# EAGLE design W107X (EAGLE 6.6.0)
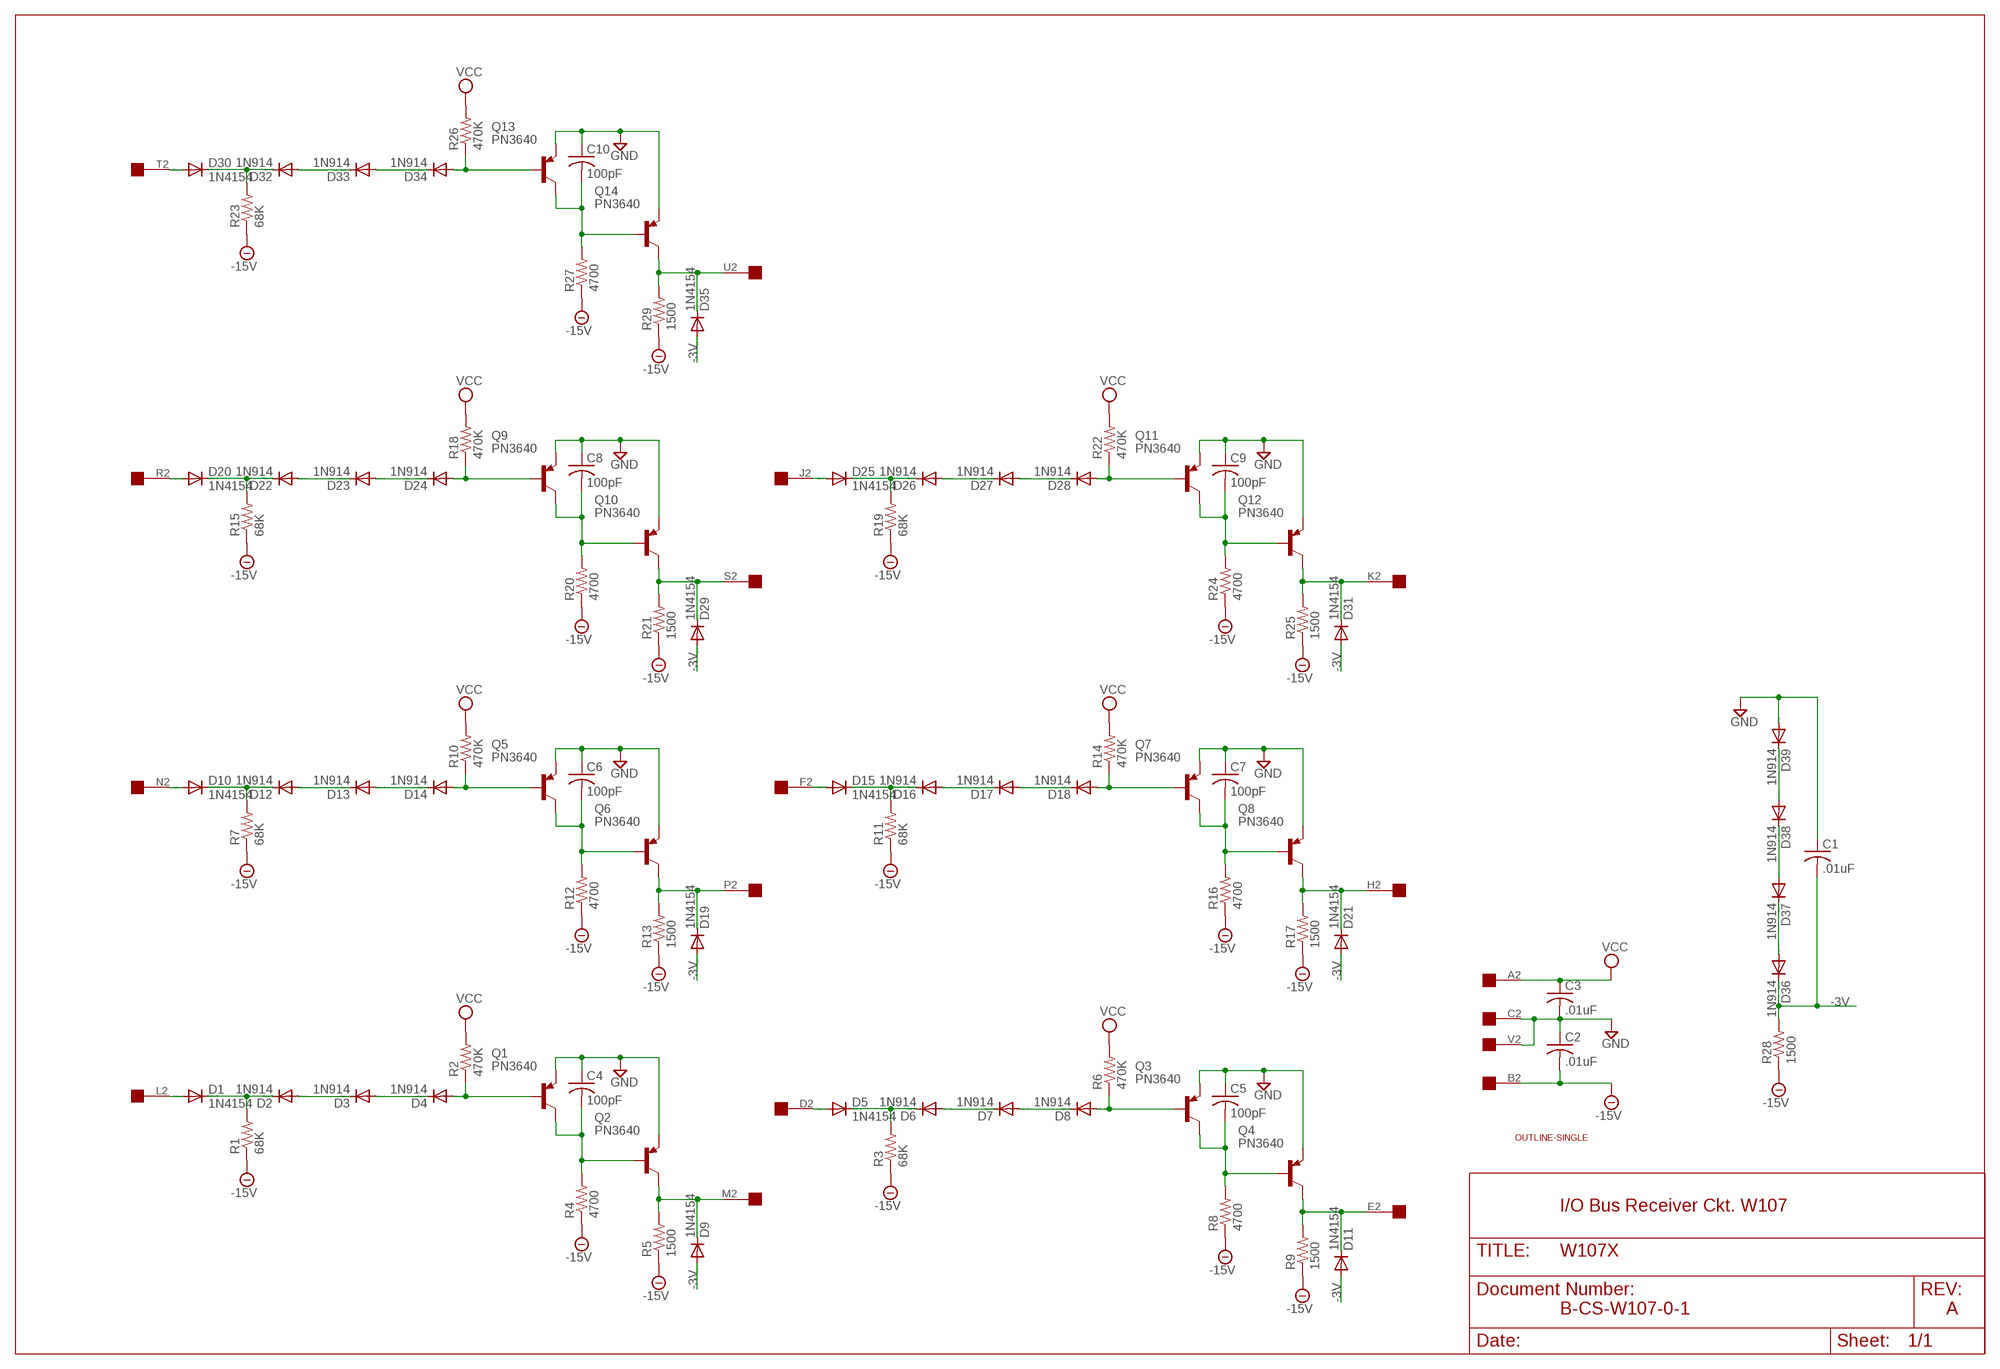
[diagram p0: schematic, sheet 1]

## Parts
C1  .01uF  C-US  [C063-025X075]
C2  .01uF  C-US  [C063-025X075]
C3  .01uF  C-US  [C063-025X075]
C4  100pF  C-US  [C063-025X075]
C5  100pF  C-US  [C063-025X075]
C6  100pF  C-US  [C063-025X075]
C7  100pF  C-US  [C063-025X075]
C8  100pF  C-US  [C063-025X075]
C9  100pF  C-US  [C063-025X075]
C10  100pF  C-US  [C063-025X075]
D1  1N4154  DIODE-DO35-10  [DO35-10]
D2  1N914  DIODE-DO35-10  [DO35-10]
D3  1N914  DIODE-DO35-10  [DO35-10]
D4  1N914  DIODE-DO35-10  [DO35-10]
D5  1N4154  DIODE-DO35-10  [DO35-10]
D6  1N914  DIODE-DO35-10  [DO35-10]
D7  1N914  DIODE-DO35-10  [DO35-10]
D8  1N914  DIODE-DO35-10  [DO35-10]
D9  1N4154  DIODE-DO35-10  [DO35-10]
D10  1N4154  DIODE-DO35-10  [DO35-10]
D11  1N4154  DIODE-DO35-10  [DO35-10]
D12  1N914  DIODE-DO35-10  [DO35-10]
D13  1N914  DIODE-DO35-10  [DO35-10]
D14  1N914  DIODE-DO35-10  [DO35-10]
D15  1N4154  DIODE-DO35-10  [DO35-10]
D16  1N914  DIODE-DO35-10  [DO35-10]
D17  1N914  DIODE-DO35-10  [DO35-10]
D18  1N914  DIODE-DO35-10  [DO35-10]
D19  1N4154  DIODE-DO35-10  [DO35-10]
D20  1N4154  DIODE-DO35-10  [DO35-10]
D21  1N4154  DIODE-DO35-10  [DO35-10]
D22  1N914  DIODE-DO35-10  [DO35-10]
D23  1N914  DIODE-DO35-10  [DO35-10]
D24  1N914  DIODE-DO35-10  [DO35-10]
D25  1N4154  DIODE-DO35-10  [DO35-10]
D26  1N914  DIODE-DO35-10  [DO35-10]
D27  1N914  DIODE-DO35-10  [DO35-10]
D28  1N914  DIODE-DO35-10  [DO35-10]
D29  1N4154  DIODE-DO35-10  [DO35-10]
D30  1N4154  DIODE-DO35-10  [DO35-10]
D31  1N4154  DIODE-DO35-10  [DO35-10]
D32  1N914  DIODE-DO35-10  [DO35-10]
D33  1N914  DIODE-DO35-10  [DO35-10]
D34  1N914  DIODE-DO35-10  [DO35-10]
D35  1N4154  DIODE-DO35-10  [DO35-10]
D36  1N914  DIODE-DO35-10  [DO35-10]
D37  1N914  DIODE-DO35-10  [DO35-10]
D38  1N914  DIODE-DO35-10  [DO35-10]
D39  1N914  DIODE-DO35-10  [DO35-10]
Q1  PN3640  -PNP-TO5  [TO5]
Q2  PN3640  -PNP-TO5  [TO5]
Q3  PN3640  -PNP-TO5  [TO5]
Q4  PN3640  -PNP-TO5  [TO5]
Q5  PN3640  -PNP-TO5  [TO5]
Q6  PN3640  -PNP-TO5  [TO5]
Q7  PN3640  -PNP-TO5  [TO5]
Q8  PN3640  -PNP-TO5  [TO5]
Q9  PN3640  -PNP-TO5  [TO5]
Q10  PN3640  -PNP-TO5  [TO5]
Q11  PN3640  -PNP-TO5  [TO5]
Q12  PN3640  -PNP-TO5  [TO5]
Q13  PN3640  -PNP-TO5  [TO5]
Q14  PN3640  -PNP-TO5  [TO5]
R1  68K  R-US_0207/10  [0207/10]
R2  470K  R-US_0207/10  [0207/10]
R3  68K  R-US_0207/10  [0207/10]
R4  4700  R-US_0207/10  [0207/10]
R5  1500  R-US_0207/10  [0207/10]
R6  470K  R-US_0207/10  [0207/10]
R7  68K  R-US_0207/10  [0207/10]
R8  4700  R-US_0207/10  [0207/10]
R9  1500  R-US_0207/10  [0207/10]
R10  470K  R-US_0207/10  [0207/10]
R11  68K  R-US_0207/10  [0207/10]
R12  4700  R-US_0207/10  [0207/10]
R13  1500  R-US_0207/10  [0207/10]
R14  470K  R-US_0207/10  [0207/10]
R15  68K  R-US_0207/10  [0207/10]
R16  4700  R-US_0207/10  [0207/10]
R17  1500  R-US_0207/10  [0207/10]
R18  470K  R-US_0207/10  [0207/10]
R19  68K  R-US_0207/10  [0207/10]
R20  4700  R-US_0207/10  [0207/10]
R21  1500  R-US_0207/10  [0207/10]
R22  470K  R-US_0207/10  [0207/10]
R23  68K  R-US_0207/10  [0207/10]
R24  4700  R-US_0207/10  [0207/10]
R25  1500  R-US_0207/10  [0207/10]
R26  470K  R-US_0207/10  [0207/10]
R27  4700  R-US_0207/10  [0207/10]
R28  1500  R-US_0207/10  [0207/10]
R29  1500  R-US_0207/10  [0207/10]
U$1  OUTLINE-SINGLE  [SINGLE]
U$2  EDGE-1  [EDGE-CON1]

## Nets
-3V: C1.2 D9.A D11.A D19.A D21.A D29.A D31.A D35.A D36.C R28.2
-15V: C2.2 R1.1 R3.1 R4.1 R5.1 R7.1 R8.1 R9.1 R11.1 R12.1 R13.1 R15.1 R16.1 R17.1 R19.1 R20.1 R21.1 R23.1 R24.1 R25.1 R27.1 R28.1 R29.1 U$2.B2
GND: C1.1 C2.1 C3.2 C4.1 C5.1 C6.1 C7.1 C8.1 C9.1 C10.1 D39.A Q1.1(E) Q2.1(E) Q3.1(E) Q4.1(E) Q5.1(E) Q6.1(E) Q7.1(E) Q8.1(E) Q9.1(E) Q10.1(E) Q11.1(E) Q12.1(E) Q13.1(E) Q14.1(E) U$2.C2 U$2.V2
N$1: D1.C D2.C R1.2
N$2: D2.A D3.C
N$3: D3.A D4.C
N$4: D4.A Q1.2(B) R2.1
N$5: D5.C D6.C R3.2
N$6: C4.2 Q1.3(C) Q2.2(B) R4.2
N$7: D9.C Q2.3(C) R5.2 U$2.M2
N$8: D6.A D7.C
N$9: D7.A D8.C
N$10: D8.A Q3.2(B) R6.1
N$11: C5.2 Q3.3(C) Q4.2(B) R8.2
N$12: D11.C Q4.3(C) R9.2 U$2.E2
N$13: D10.C D12.C R7.2
N$14: D12.A D13.C
N$15: D13.A D14.C
N$16: D14.A Q5.2(B) R10.1
N$17: C6.2 Q5.3(C) Q6.2(B) R12.2
N$18: D19.C Q6.3(C) R13.2 U$2.P2
N$19: D15.C D16.C R11.2
N$20: D16.A D17.C
N$21: D17.A D18.C
N$22: D18.A Q7.2(B) R14.1
N$23: C7.2 Q7.3(C) Q8.2(B) R16.2
N$24: D21.C Q8.3(C) R17.2 U$2.H2
N$25: D20.C D22.C R15.2
N$26: D22.A D23.C
N$27: D23.A D24.C
N$28: D24.A Q9.2(B) R18.1
N$29: C8.2 Q9.3(C) Q10.2(B) R20.2
N$30: D29.C Q10.3(C) R21.2 U$2.S2
N$31: D25.C D26.C R19.2
N$32: D26.A D27.C
N$33: D27.A D28.C
N$34: D28.A Q11.2(B) R22.1
N$35: C9.2 Q11.3(C) Q12.2(B) R24.2
N$36: D31.C Q12.3(C) R25.2 U$2.K2
N$37: D30.C D32.C R23.2
N$38: D32.A D33.C
N$39: D33.A D34.C
N$40: D34.A Q13.2(B) R26.1
N$41: C10.2 Q13.3(C) Q14.2(B) R27.2
N$42: D35.C Q14.3(C) R29.2 U$2.U2
N$43: D5.A U$2.D2
N$44: D36.A D37.C
N$45: D38.A D39.C
N$46: D37.A D38.C
N$47: D30.A U$2.T2
N$48: D20.A U$2.R2
N$49: D10.A U$2.N2
N$50: D1.A U$2.L2
N$51: D15.A U$2.F2
N$52: D25.A U$2.J2
VCC: C3.1 R2.2 R6.2 R10.2 R14.2 R18.2 R22.2 R26.2 U$2.A2

## Notes on the sheet
- I/O Bus Receiver Ckt. W107
- B-CS-W107-0-1 | A

## Library data of the parts
C1-C10 = dec-con:C-US: Capacitors with funky DEC lead spacing.
D1-D39 = diode:DIODE-: DIODE
Q1-Q14 = transistor:*-PNP-: PNP Transistror
R1-R29 = rcl:R-US_: RESISTOR, American symbol
U$1 = dec-con:OUTLINE-*: Board outlines for DEC boards.
U$2 = dec-con:EDGE-1: Single-Sided DEC Edge Connector -- (side 2)

## Net classes
0 default: width 0.813 mm

## Board
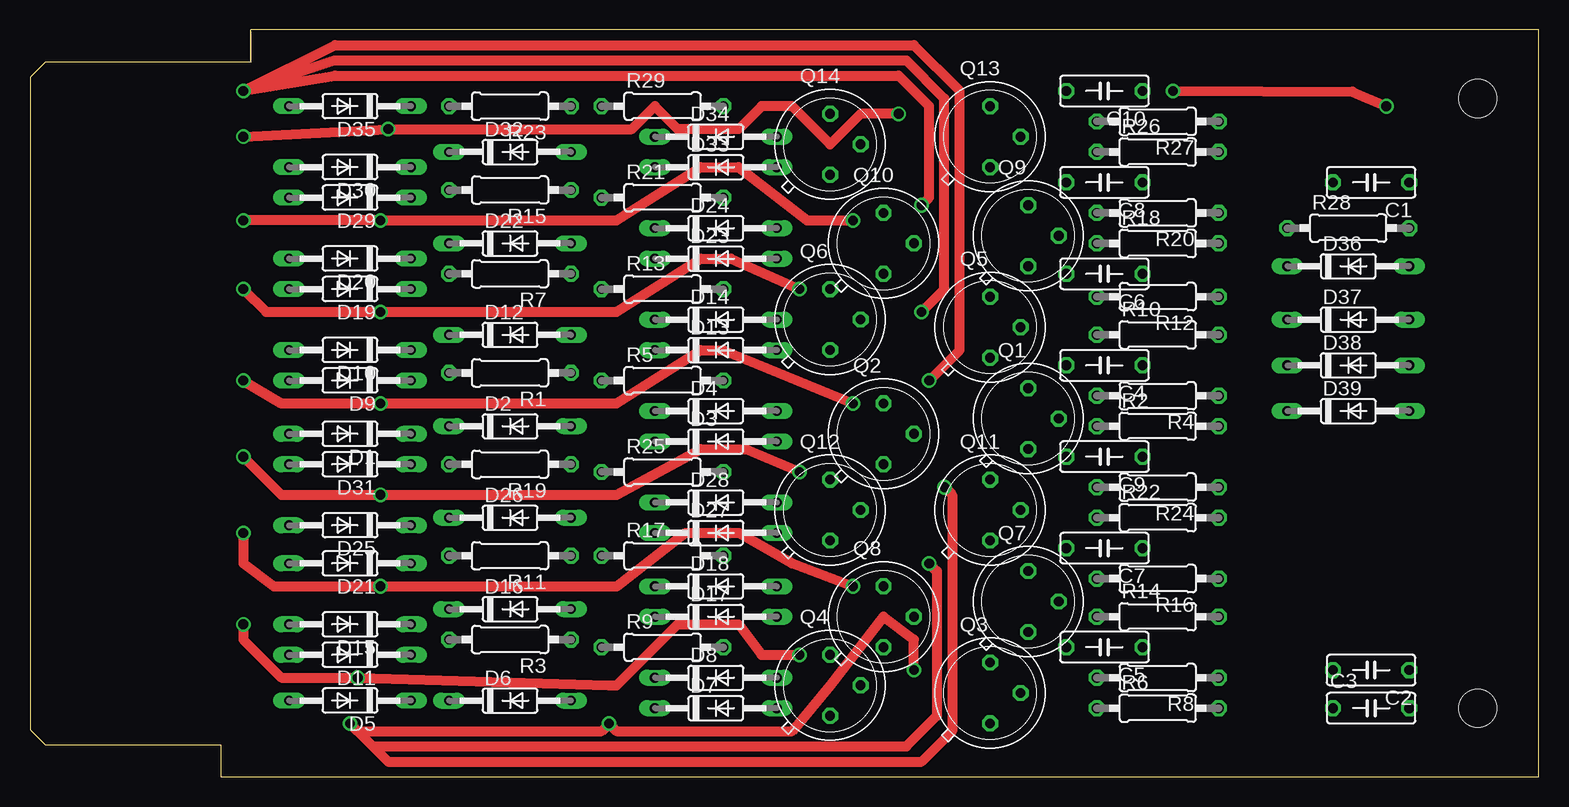
[diagram p1: board, top side]
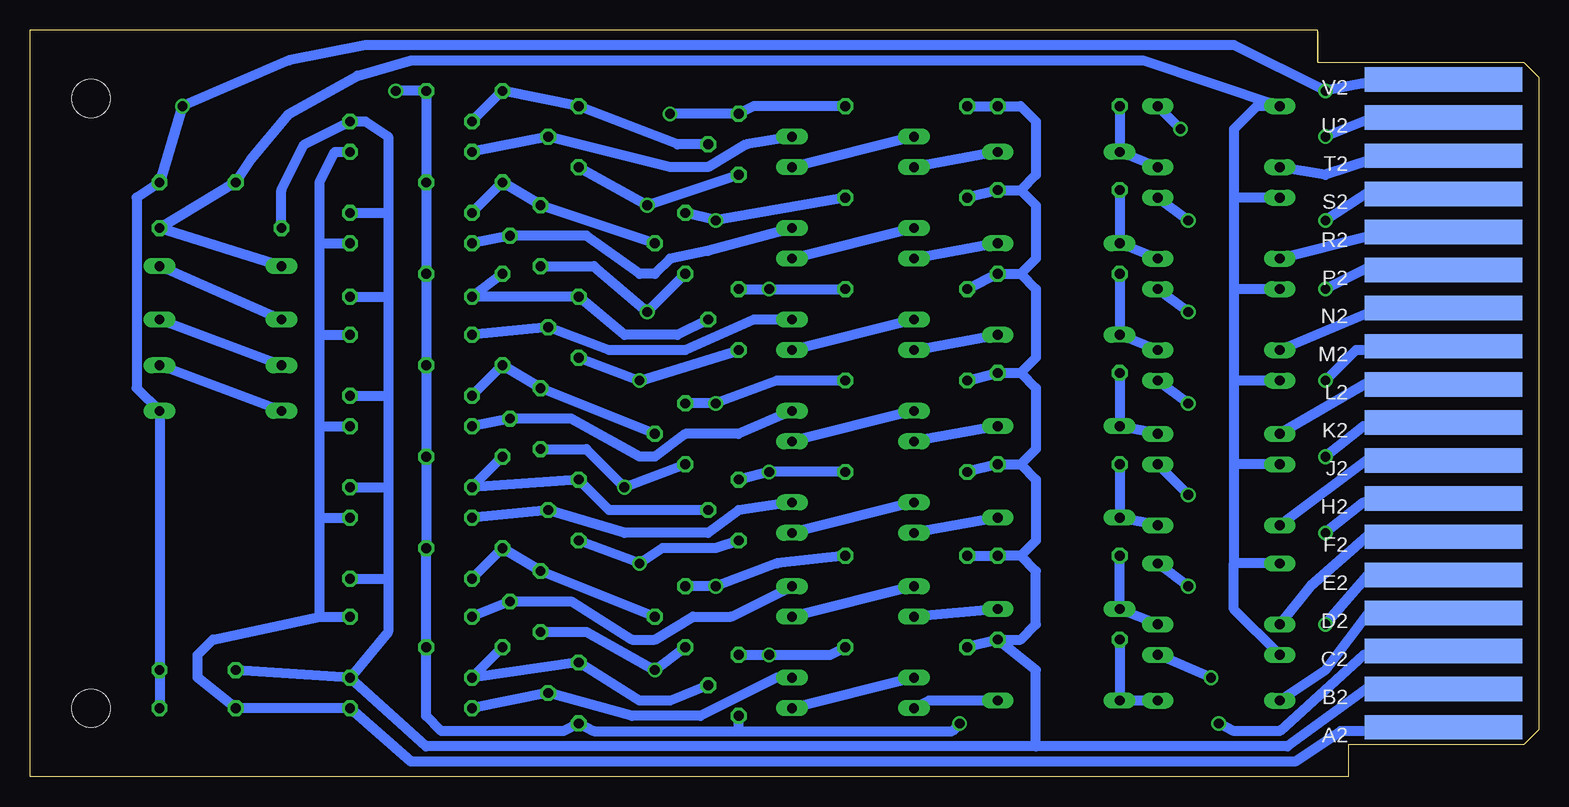
[diagram p2: board, bottom side, seen from below]

Size 125.73 x 62.23 mm. Coordinates in mm from the lower left corner, seen from the top.
Copper layers (1+16): Top 0.035mm / dielectric 1.5mm / Bottom 0.035mm
Design rules "16mils": minimum track width 16mil, minimum drill 32mil, track to track 15mil, track to pad 10mil, pad to pad 10mil, via to via 10mil, smd to smd 10mil, copper to edge 13mil, drill to drill 10mil, minimum pad ring 10mil, minimum via ring 8mil, stop-mask expansion 0mil, vias tented up to drill 0mil, thermal gap 10mil

### Footprints (pad centres in the part's own frame; a part is rotated, then mirrored left to right if it is on the bottom)
C063-025X075 = drill 0.813 octagon: 1 -2.54,0; 2 3.81,0
DO35-10 = drill 0.813 long: A 5.08,0; C -5.08,0
TO5 = drill 0.813 octagon: 1 0,-2.54; 2 2.54,0; 3 0,2.54
0207/10 = drill 0.813 octagon: 1 -5.08,0; 2 5.08,0
SINGLE = hole 3.175: 120.65,56.515; 120.65,5.715
EDGE-CON1 = smd 13.106 x 2.032 bottom: A2 7.938,4.128; B2 7.938,7.303; C2 7.938,10.477; D2 7.938,13.652; E2 7.938,16.828; F2 7.938,20.003; H2 7.938,23.177; J2 7.938,26.352; K2 7.938,29.527; L2 7.938,32.703; M2 7.938,35.877; N2 7.938,39.053; P2 7.938,42.227; R2 7.938,45.403; S2 7.938,48.578; T2 7.938,51.752; U2 7.938,54.928; V2 7.938,58.102

### Placement (x,y rotation side)
C1  112.4,49.53 180 top
C2  112.4,8.89 180 top
C3  111.13,5.71 0 top
C4  90.17,34.29 180 top
C5  90.17,10.79 180 top
C6  90.17,41.91 180 top
C7  90.17,19.05 180 top
C8  90.17,49.53 180 top
C9  90.17,26.67 180 top
C10  90.17,57.15 180 top
D1  26.67,28.57 180 top
D2  40.01,29.21 0 top
D3  57.15,27.94 0 top
D4  57.15,30.48 0 top
D5  26.67,6.35 180 top
D6  40.01,6.35 0 top
D7  57.15,5.71 0 top
D8  57.15,8.26 0 top
D9  26.67,33.02 180 top
D10  26.67,35.56 180 top
D11  26.67,10.16 180 top
D12  40.01,36.83 0 top
D13  57.15,35.56 0 top
D14  57.15,38.1 0 top
D15  26.67,12.7 180 top
D16  40.01,13.97 0 top
D17  57.15,13.34 0 top
D18  57.15,15.88 0 top
D19  26.67,40.64 180 top
D20  26.67,43.18 180 top
D21  26.67,17.78 180 top
D22  40.01,44.45 0 top
D23  57.15,43.18 0 top
D24  57.15,45.72 0 top
D25  26.67,20.95 180 top
D26  40.01,21.59 0 top
D27  57.15,20.32 0 top
D28  57.15,22.86 0 top
D29  26.67,48.26 180 top
D30  26.67,50.8 180 top
D31  26.67,26.04 180 top
D32  40.01,52.07 0 top
D33  57.15,50.8 0 top
D34  57.15,53.34 0 top
D35  26.67,55.88 180 top
D36  109.86,42.55 0 top
D37  109.86,38.1 0 top
D38  109.86,34.29 0 top
D39  109.86,30.48 0 top
Q1  83.19,29.84 0 top
Q2  71.12,28.57 0 top
Q3  80.01,6.99 0 top
Q4  66.68,7.62 0 top
Q5  80.01,37.47 0 top
Q6  66.68,38.1 0 top
Q7  83.19,14.61 0 top
Q8  71.12,13.34 0 top
Q9  83.19,45.09 0 top
Q10  71.12,44.45 0 top
Q11  80.01,22.23 0 top
Q12  66.68,22.23 0 top
Q13  80.01,53.34 0 top
Q14  66.68,52.7 0 top
R1  40.01,33.66 180 top
R2  93.98,29.21 0 top
R3  40.01,11.43 180 top
R4  93.98,31.75 180 top
R5  52.71,33.02 0 top
R6  93.98,5.71 0 top
R7  40.01,41.91 180 top
R8  93.98,8.26 180 top
R9  52.71,10.79 0 top
R10  93.98,36.83 0 top
R11  40.01,18.41 180 top
R12  93.98,40.01 180 top
R13  52.71,40.64 0 top
R14  93.98,13.34 0 top
R15  40.01,48.9 180 top
R16  93.98,16.51 180 top
R17  52.71,18.41 0 top
R18  93.98,44.45 0 top
R19  40.01,26.04 180 top
R20  93.98,46.99 180 top
R21  52.71,48.26 0 top
R22  93.98,21.59 0 top
R23  40.01,55.88 180 top
R24  93.98,24.13 180 top
R25  52.71,25.4 0 top
R26  93.98,52.07 0 top
R27  93.98,54.61 180 top
R28  109.86,45.72 0 top
R29  52.71,55.88 0 top
U$1  0,0 0 top
U$2  0,0 0 top

### Tracks (layer width: path | path; a pad name or v marks a point on that pad's centre or on a via)
-3V
  Bottom 0.813: D21.A 25.4,17.78 | D11.A 25.4,13.97 25.4,17.78 | D31.A 25.4,26.04 | 25.4,26.04 25.4,17.78 | D19.A 25.4,40.64 | 25.4,40.64 25.4,33.02 | 25.4,33.02 25.4,26.04 | D9.A 25.4,33.02 | D29.A 25.4,48.26 | 25.4,48.26 25.4,40.64 | 25.4,48.26 25.4,53.98 23.5,55.88 D35.A 33.02,59.69 93.98,59.69 98.43,58.42 104.14,55.24 107.32,51.44 C1.2 R28.2 D36.C
-15V
  Bottom 0.813: U$2.B2 8.89,7.62 13.97,7.62 20.96,2.54 41.91,2.54 | 41.91,2.54 41.91,8.89 R3.1 | 41.91,2.54 92.71,2.54 R8.1 | R3.1 43.18,11.43 41.91,12.7 41.91,17.14 43.18,18.41 | 43.18,18.41 R11.1 R17.1 | 43.18,26.04 R19.1 R25.1 | 43.18,26.04 41.91,24.77 41.91,19.68 43.18,18.41 | 43.18,33.66 R1.1 R5.1 | 43.18,33.66 41.91,32.38 41.91,27.3 43.18,26.04 | 43.18,41.91 R7.1 R13.1 | 43.18,41.91 41.91,40.64 41.91,34.92 43.18,33.66 | 43.18,48.9 R15.1 R21.1 | 43.18,48.9 41.91,47.62 41.91,43.18 43.18,41.91 | 43.18,48.9 41.91,50.16 41.91,54.61 43.18,55.88 R23.1 R29.1 | R3.1 R9.1 | R28.1 104.78,48.9 102.87,52.7 R27.1 97.79,54.61 95.89,53.34 95.89,46.99 | 95.89,46.99 95.89,40.01 | 95.89,40.01 95.89,31.75 | 95.89,31.75 95.89,24.13 | 95.89,24.13 95.89,16.51 | 95.89,16.51 95.89,12.06 R8.1 | R8.1 C2.2 | R20.1 95.89,46.99 | R12.1 95.89,40.01 | R16.1 95.89,16.51 | R24.1 95.89,24.13 | R4.1 95.89,31.75
GND  (via drill 0.81)
  Top 0.813: 27.31,3.81 28.58,2.54 | 28.58,2.54 29.85,1.27 74.3,1.27 76.84,3.81 76.84,23.5 v76.2,24.13 | 28.58,2.54 73.03,2.54 75.57,5.08 75.57,17.14 v74.93,17.78 | v26.67,4.45 27.31,3.81 | 27.31,3.81 47.63,3.81 v48.26,4.45 48.9,3.81 63.5,3.81 66.68,7.62 71.12,13.34 73.66,11.43 v73.66,8.89 | v95.25,57.15 110.19,57.09 v113.03,55.88 | v17.78,57.15 25.4,60.96 73.66,60.96 77.47,57.15 77.47,35.56 v74.93,33.02 | v17.78,57.15 25.4,59.69 73.03,59.69 76.2,56.52 76.2,40.64 v74.3,38.73 | v17.78,57.15 25.4,58.42 72.39,58.42 74.93,55.88 74.93,48.26 v74.3,47.62
  Bottom 0.813: U$2.C2 8.89,10.16 14.61,10.16 21.59,3.81 25.4,3.81 v26.67,4.45 | 66.68,3.81 78.74,3.81 Q3.1 81.28,3.81 91.44,3.81 92.71,5.08 C5.1 C7.1 C9.1 C4.1 C6.1 C8.1 C10.1 v95.25,57.15 | 66.68,3.81 Q4.1 | U$2.V2 8.89,57.78 14.61,57.78 v17.78,57.15 25.4,60.96 97.79,60.96 104.14,59.69 v113.03,55.88 C1.1 116.84,48.26 116.84,32.38 D39.A C2.1 C3.2 | 66.68,3.81 48.9,3.81 v48.26,4.45 | Q7.1 79.38,12.06 v73.66,8.89 Q8.1 | Q10.1 v74.3,38.73 78.74,42.55 Q9.1 | Q5.1 v74.93,33.02 Q6.1 | Q14.1 v74.3,47.62 Q13.1 | Q1.1 79.38,27.3 v76.2,24.13 Q2.1 | Q12.1 68.58,19.05 73.03,19.05 v74.93,17.78 Q11.1
N$1
  Bottom 0.813: D1.C D2.C R1.2
N$2
  Bottom 0.813: D2.A D3.C
N$3
  Bottom 0.813: D4.C D3.A
N$4
  Bottom 0.813: D4.A 66.68,28.57 71.12,28.57 73.66,26.67 74.93,26.67 80.65,29.84 Q1.2 R2.1
N$5
  Bottom 0.813: D5.C D6.C R3.2
N$6
  Bottom 0.813: R4.2 C4.2 Q1.3 Q2.2
N$7  (via drill 0.81)
  Top 0.813: v17.78,33.02 20.96,31.11 v29.21,31.11 48.9,31.11 55.88,35.56 57.79,35.56 v68.58,31.11
  Bottom 0.813: U$2.M2 8.89,35.56 15.24,35.56 v17.78,33.02 | v29.21,31.11 D9.C | R5.2 63.5,33.02 v68.58,31.11 Q2.3
N$8
  Bottom 0.813: D6.A 50.8,6.35 D7.C
N$9
  Bottom 0.813: D8.C D7.A
N$10
  Bottom 0.813: D8.A 63.5,8.26 69.85,5.08 75.57,5.08 Q3.2 R6.1
N$11
  Bottom 0.813: Q4.2 72.39,6.35 74.93,6.35 Q3.3 R8.2 C5.2
N$12  (via drill 0.81)
  Top 0.813: v17.78,12.7 17.78,11.43 20.96,8.26 v27.31,8.26 48.26,7.62 48.9,7.62 53.98,12.7 59.06,12.7 60.96,10.16 v64.14,10.16
  Bottom 0.813: U$2.E2 10.16,17.14 13.97,17.14 v17.78,12.7 | v27.31,8.26 D11.C | Q4.3 v64.14,10.16 59.06,10.16 R9.2
N$13
  Bottom 0.813: D10.C D12.C R7.2
N$14
  Bottom 0.813: D13.C D12.A
N$15
  Bottom 0.813: D14.C D13.A
N$16
  Bottom 0.813: R10.1 Q5.2 77.47,35.56 71.12,35.56 65.41,38.1 D14.A
N$17
  Bottom 0.813: C6.2 R12.2 Q5.3 76.2,36.83 71.76,36.83 Q6.2
N$18  (via drill 0.81)
  Top 0.813: v17.78,40.64 19.69,38.73 v29.21,38.73 48.9,38.73 55.88,43.18 58.42,43.18 v64.14,40.64
  Bottom 0.813: U$2.P2 8.89,42.55 13.97,42.55 v17.78,40.64 | v29.21,38.73 D19.C | Q6.3 v64.14,40.64 R13.2
N$19
  Bottom 0.813: R11.2 D16.C D15.C
N$20
  Bottom 0.813: D16.A D17.C
N$21
  Bottom 0.813: D18.C D17.A
N$22
  Bottom 0.813: D18.A 67.31,13.34 70.49,13.34 73.66,11.43 75.57,11.43 80.65,14.61 Q7.2 R14.1
N$23
  Bottom 0.813: Q8.2 Q7.3 C7.2 R16.2
N$24  (via drill 0.81)
  Top 0.813: v17.78,20.32 17.78,17.78 20.32,15.88 v29.21,15.88 48.9,15.88 54.61,20.32 59.06,20.32 63.5,17.78 v68.58,15.88
  Bottom 0.813: U$2.H2 8.89,22.86 14.61,22.86 v17.78,20.32 | v29.21,15.88 D21.C | R17.2 63.5,17.78 v68.58,15.88 Q8.3
N$25
  Bottom 0.813: D20.C D22.C R15.2
N$26
  Bottom 0.813: D22.A D23.C
N$27
  Bottom 0.813: D24.C D23.A
N$28
  Bottom 0.813: R18.1 Q9.2 79.38,45.09 74.93,41.91 73.66,41.91 72.39,43.18 69.22,43.81 D24.A
N$29
  Bottom 0.813: Q10.2 Q9.3 C8.2 R20.2
N$30  (via drill 0.81)
  Top 0.813: v17.78,46.35 v29.21,46.35 48.9,46.35 55.88,50.8 59.06,50.8 64.77,46.35 v68.58,46.35
  Bottom 0.813: D29.C v29.21,46.35 | v17.78,46.35 13.97,48.9 8.26,48.9 U$2.S2 | R21.2 v68.58,46.35 Q10.3
N$31
  Bottom 0.813: D25.C D26.C R19.2
N$32
  Bottom 0.813: D26.A D27.C
N$33
  Bottom 0.813: D28.C D27.A
N$34
  Bottom 0.813: R22.1 Q11.2 76.2,20.32 69.22,20.32 66.68,22.23 D28.A
N$35
  Bottom 0.813: C9.2 R24.2 Q11.3 77.47,22.23 Q12.2
N$36  (via drill 0.81)
  Top 0.813: v17.78,26.67 20.96,23.5 v29.21,23.5 48.9,23.5 55.88,27.3 59.69,27.3 v64.14,25.4
  Bottom 0.813: U$2.K2 8.89,29.21 14.61,29.21 v17.78,26.67 | v29.21,23.5 D31.C | R25.2 v64.14,25.4 Q12.3
N$37
  Bottom 0.813: D30.C D32.C R23.2
N$38
  Bottom 0.813: D32.A D33.C
N$39
  Bottom 0.813: D34.C D33.A
N$40
  Bottom 0.813: R26.1 Q13.2 72.39,50.8 69.22,50.8 66.04,52.7 D34.A
N$41
  Bottom 0.813: Q14.2 71.76,52.7 Q13.3 C10.2 R27.2
N$42  (via drill 0.81)
  Top 0.813: v17.78,53.34 v29.85,53.98 50.17,53.98 52.07,55.88 53.98,53.98 59.06,53.98 60.96,55.88 63.5,55.88 66.68,52.7 69.22,55.24 v72.39,55.24
  Bottom 0.813: U$2.U2 8.89,54.61 14.61,54.61 v17.78,53.34 | v29.85,53.98 D35.C | R29.2 65.41,55.88 Q14.3 v72.39,55.24
N$43
  Bottom 0.813: U$2.D2 8.89,13.97 13.97,13.97 17.78,8.89 D5.A
N$44
  Bottom 0.813: D37.C D36.A
N$45
  Bottom 0.813: D39.C D38.A
N$46
  Bottom 0.813: D38.C D37.A
N$47
  Bottom 0.813: U$2.T2 8.89,51.44 13.97,51.44 17.78,50.16 D30.A
N$48
  Bottom 0.813: U$2.R2 8.89,45.09 13.97,45.09 D20.A
N$49
  Bottom 0.813: U$2.N2 8.89,38.73 13.97,38.73 D10.A
N$50
  Bottom 0.813: U$2.L2 8.89,33.02 13.97,33.02 D1.A
N$51
  Bottom 0.813: U$2.F2 8.89,20.32 13.97,20.32 19.05,15.88 D15.A
N$52
  Bottom 0.813: U$2.J2 8.89,26.67 13.97,26.67 D25.A
VCC
  Bottom 0.813: U$2.A2 8.89,3.81 16.51,3.81 20.32,1.27 93.98,1.27 R6.2 C3.1 111.76,8.26 111.76,10.16 110.49,11.43 101.6,13.34 | 101.6,13.34 101.6,21.59 | 101.6,21.59 101.6,29.21 | 101.6,29.21 101.6,36.83 | 101.6,36.83 101.6,44.45 | 101.6,44.45 101.6,49.53 100.33,52.07 R26.2 | 101.6,44.45 R18.2 | 101.6,36.83 R10.2 | 101.6,29.21 R2.2 | 101.6,21.59 R22.2 | 101.6,13.34 R14.2

### Text on the board
200bmp: C:/Users/Vince/Documents/eagle/projects/DEC/Wxxx/W107/W107Bbackfb.bmp